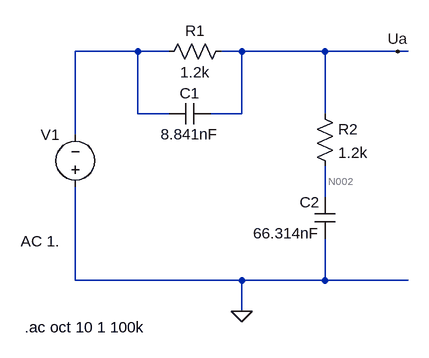
[diagram p0: schematic Lab7TPHPschaltung.asc]
Lab7TPHPschaltung.asc, the LTspice schematic file:
Version 4
SHEET 1 880 680
WIRE 144 0 48 0
WIRE 192 0 144 0
WIRE 304 0 272 0
WIRE 432 0 304 0
WIRE 544 0 432 0
WIRE 560 0 544 0
WIRE 144 96 144 0
WIRE 192 96 144 96
WIRE 304 96 304 0
WIRE 304 96 256 96
WIRE 432 96 432 0
WIRE 48 128 48 0
WIRE 432 224 432 176
WIRE 48 352 48 208
WIRE 304 352 48 352
WIRE 432 352 432 288
WIRE 432 352 304 352
WIRE 560 352 432 352
WIRE 304 400 304 352
FLAG 304 400 0
FLAG 544 0 Ua
SYMBOL voltage 48 224 R180
WINDOW 0 24 96 Left 2
WINDOW 3 24 -40 Left 2
WINDOW 123 24 -68 Left 2
WINDOW 39 0 0 Left 0
SYMATTR InstName V1
SYMATTR Value ""
SYMATTR Value2 AC 1.
SYMBOL res 288 -16 R90
WINDOW 0 0 56 VBottom 2
WINDOW 3 32 56 VTop 2
SYMATTR InstName R1
SYMATTR Value 1.2k
SYMBOL cap 192 80 M90
WINDOW 0 0 32 VBottom 2
WINDOW 3 32 32 VTop 2
SYMATTR InstName C1
SYMATTR Value 8.841nF
SYMBOL cap 448 288 R180
WINDOW 0 24 56 Left 2
WINDOW 3 24 8 Left 2
SYMATTR InstName C2
SYMATTR Value 66.314nF
SYMBOL res 416 80 R0
SYMATTR InstName R2
SYMATTR Value 1.2k
TEXT -30 424 Left 2 !.ac oct 10 1 100k

The netlist it stands for:
* Lab7TPHPschaltung.asc
V1 0 N001 AC 1.
R1 Ua N001 1.2k
C1 N001 Ua 8.841nF
C2 0 N002 66.314nF
R2 Ua N002 1.2k
.ac oct 10 1 100k
.backanno
.end

* Results of the author's LTspice run, read from the files saved beside the schematic
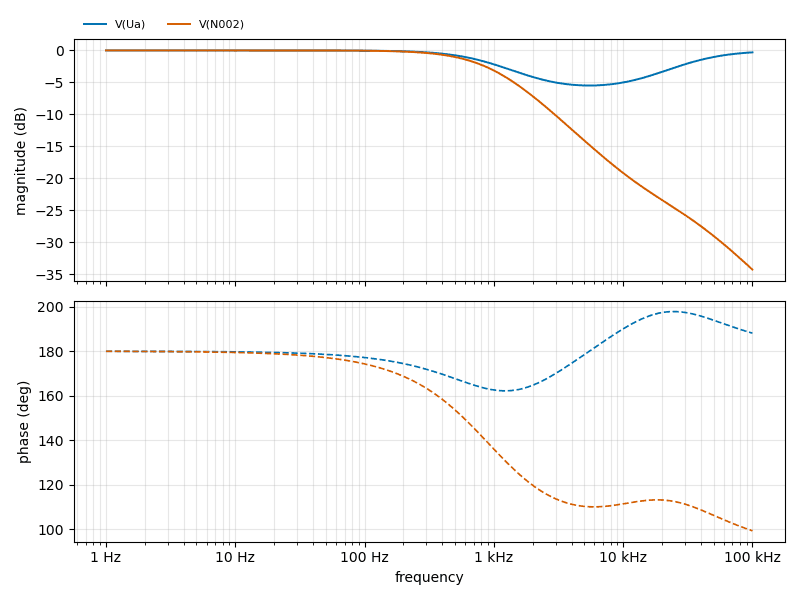
[diagram p1: AC Analysis of Lab7TPHPschaltung.asc, plotted from the saved traces]
* AC Analysis, 1 run:
*   V(Ua): -0.00 dB at 1 Hz, -0.30 dB at 100 kHz, peak -0.00 dB at 1 Hz, 3 dB below the peak at 1.336 kHz
*   V(N002): -0.00 dB at 1 Hz, -34.28 dB at 100 kHz, peak -0.00 dB at 1 Hz, 3 dB below the peak at 969.4 Hz